# Altium schematic sheet 2015-02-15_05-56-421.schdoc
size 312 x 144 mm; SheetNumber: 1; SheetTotal: 1
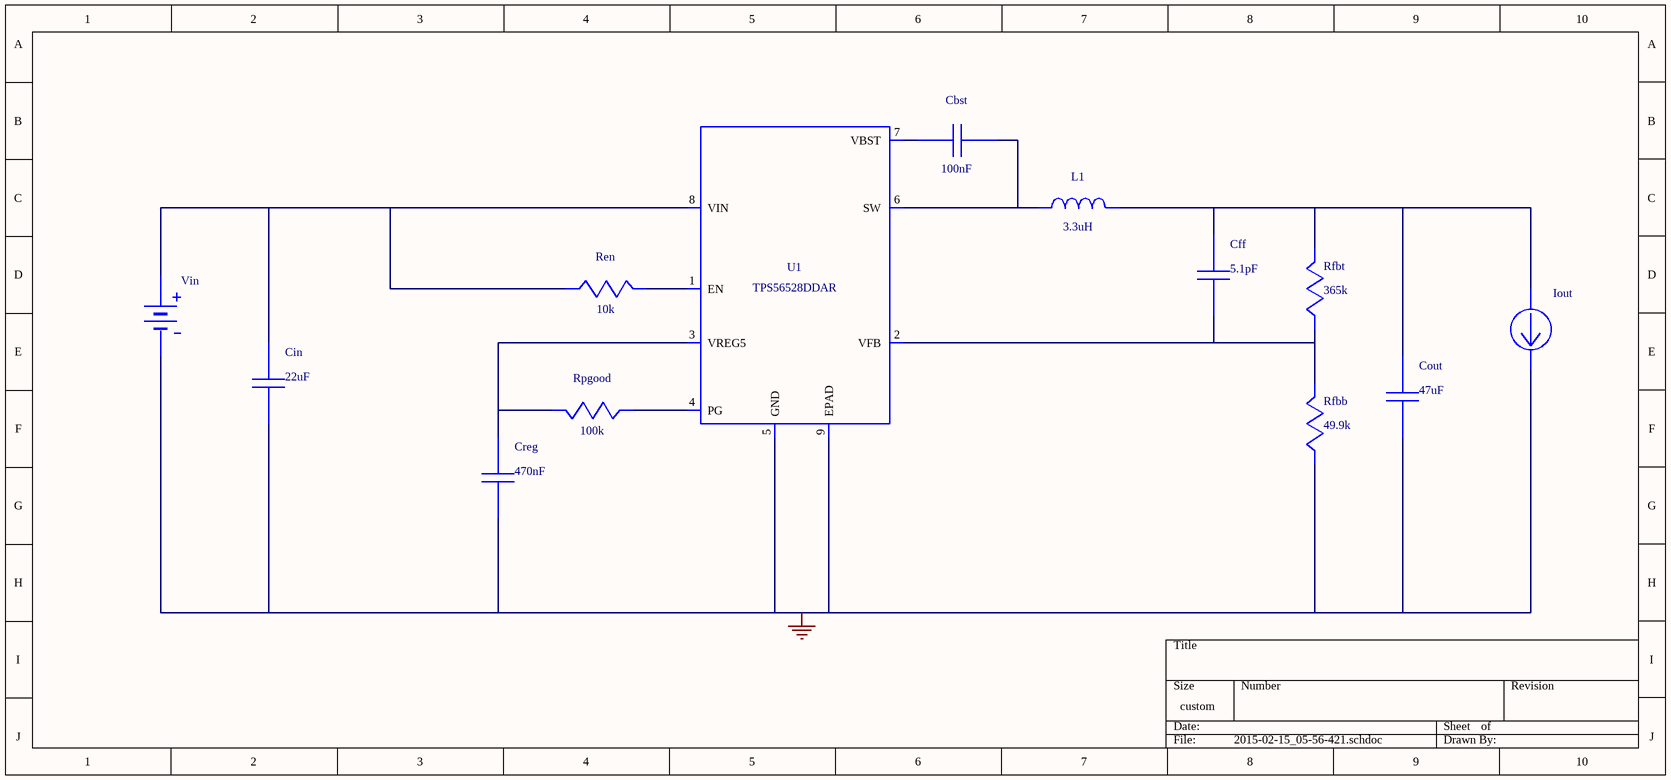
[diagram p0: 2015-02-15_05-56-421.schdoc]

## Parts
Cbst  value 100nF  (hidden comment: C1005X5R1A104K)
Cff  value 5.1pF  (hidden comment: GRM1555C1E5R1CA01D)
Cin  value 22uF  (hidden comment: GRM32ER61E226KE15L)
Cout  value 47uF  (hidden comment: C3216X6S1A476M)
Creg  value 470nF  (hidden comment: GRM155R61A474KE15D)
Iout  WB_CURRENT_LOAD  (value not drawn)
L1  value 3.3uH  (hidden comment: IHLP3232DZER3R3M01)
Ren  value 10k  (hidden comment: CRCW040210K0FKED)
Rfbb  value 49.9k  (hidden comment: CRCW040249K9FKED)
Rfbt  value 365k  (hidden comment: CRCW0402365KFKED)
Rpgood  value 100k  (hidden comment: CRCW0402100KFKED)
U1  TPS56528DDAR
Vin  WB_BATTERY  (value not drawn)

## Nets
0: Cin.2 Cout.2 Creg.2 Iout.2(-) Rfbb.2 U1.5(GND) U1.9(EPAD) Vin.2(-)
NetCbst_1: Cbst.1 U1.7(VBST)
NetCbst_2: Cbst.2 L1.1 U1.6(SW)
NetCff_1: Cff.1 Cout.1 Iout.1(+) L1.2 Rfbt.1
NetCff_2: Cff.2 Rfbb.1 Rfbt.2 U1.2(VFB)
NetCin_1: Cin.1 Ren.2 U1.8(VIN) Vin.1(+)
NetCreg_1: Creg.1 Rpgood.1 U1.3(VREG5)
NetRen_1: Ren.1 U1.1(EN)
NetRpgood_2: Rpgood.2 U1.4(PG)

## Library data of the parts
Cbst = C1005X5R1A104K: Manufacturer Name: TDK; PackageReference: C1005X5R1A104K; Manufacturer Part Number: C1005X5R1A104K
Cff = GRM1555C1E5R1CA01D: GRM1555C1E5R1CA0; Manufacturer Name: MuRata; PackageReference: GRM1555C1E5R1CA01D; Manufacturer Part Number: GRM1555C1E5R1CA01D
Cin = GRM32ER61E226KE15L: GRM32ER61E226KE1; Manufacturer Name: MuRata; PackageReference: GRM32ER61E226KE15L; Manufacturer Part Number: GRM32ER61E226KE15L
Cout = C3216X6S1A476M: Manufacturer Name: TDK; PackageReference: C3216X6S1A476M; Manufacturer Part Number: C3216X6S1A476M
Creg = GRM155R61A474KE15D: GRM155R61A474KE1; Manufacturer Name: MuRata; PackageReference: GRM155R61A474KE15D; Manufacturer Part Number: GRM155R61A474KE15D
Iout = WB_CURRENT_LOAD: Value: UNLISTED; PackageReference: WB_CURRENT_LOAD; Manufacturer Part Number: WB_CURRENT_LOAD; Manufacturer Name: WB_CURRENT_LOAD
L1 = IHLP3232DZER3R3M01: Unknown; Manufacturer Name: Vishay-Dale; PackageReference: IHLP3232DZER3R3M01; Manufacturer Part Number: IHLP3232DZER3R3M01
Ren = CRCW040210K0FKED: Manufacturer Name: Vishay-Dale; PackageReference: CRCW040210K0FKED; Manufacturer Part Number: CRCW040210K0FKED
Rfbb = CRCW040249K9FKED: Manufacturer Name: Vishay-Dale; PackageReference: CRCW040249K9FKED; Manufacturer Part Number: CRCW040249K9FKED
Rfbt = CRCW0402365KFKED: Manufacturer Name: Vishay-Dale; PackageReference: CRCW0402365KFKED; Manufacturer Part Number: CRCW0402365KFKED
Rpgood = CRCW0402100KFKED: Manufacturer Name: Vishay-Dale; PackageReference: CRCW0402100KFKED; Manufacturer Part Number: CRCW0402100KFKED
U1 = TPS56528DDAR: Manufacturer Name: Texas Instruments; Value: UNLISTED; PackageReference: TPS56528DDAR; Manufacturer Part Number: TPS56528DDAR
Vin = WB_BATTERY: Value: UNLISTED; PackageReference: WB_BATTERY; Manufacturer Part Number: WB_BATTERY; Manufacturer Name: WB_BATTERY